# Altium schematic sheet fullCURRENT power cover.SchDoc
size A; Author: JNutzmann; DocumentNumber: 1
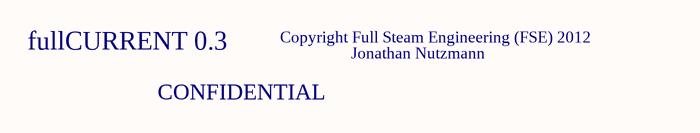
[diagram p0: fullCURRENT power cover.SchDoc]

## Notes on the sheet
- fullCURRENT 0.3
- Copyright Full Steam Engineering (FSE) 2012
- CONFIDENTIAL
- Jonathan Nutzmann